# Altium project PCB_Project.PrjPcb
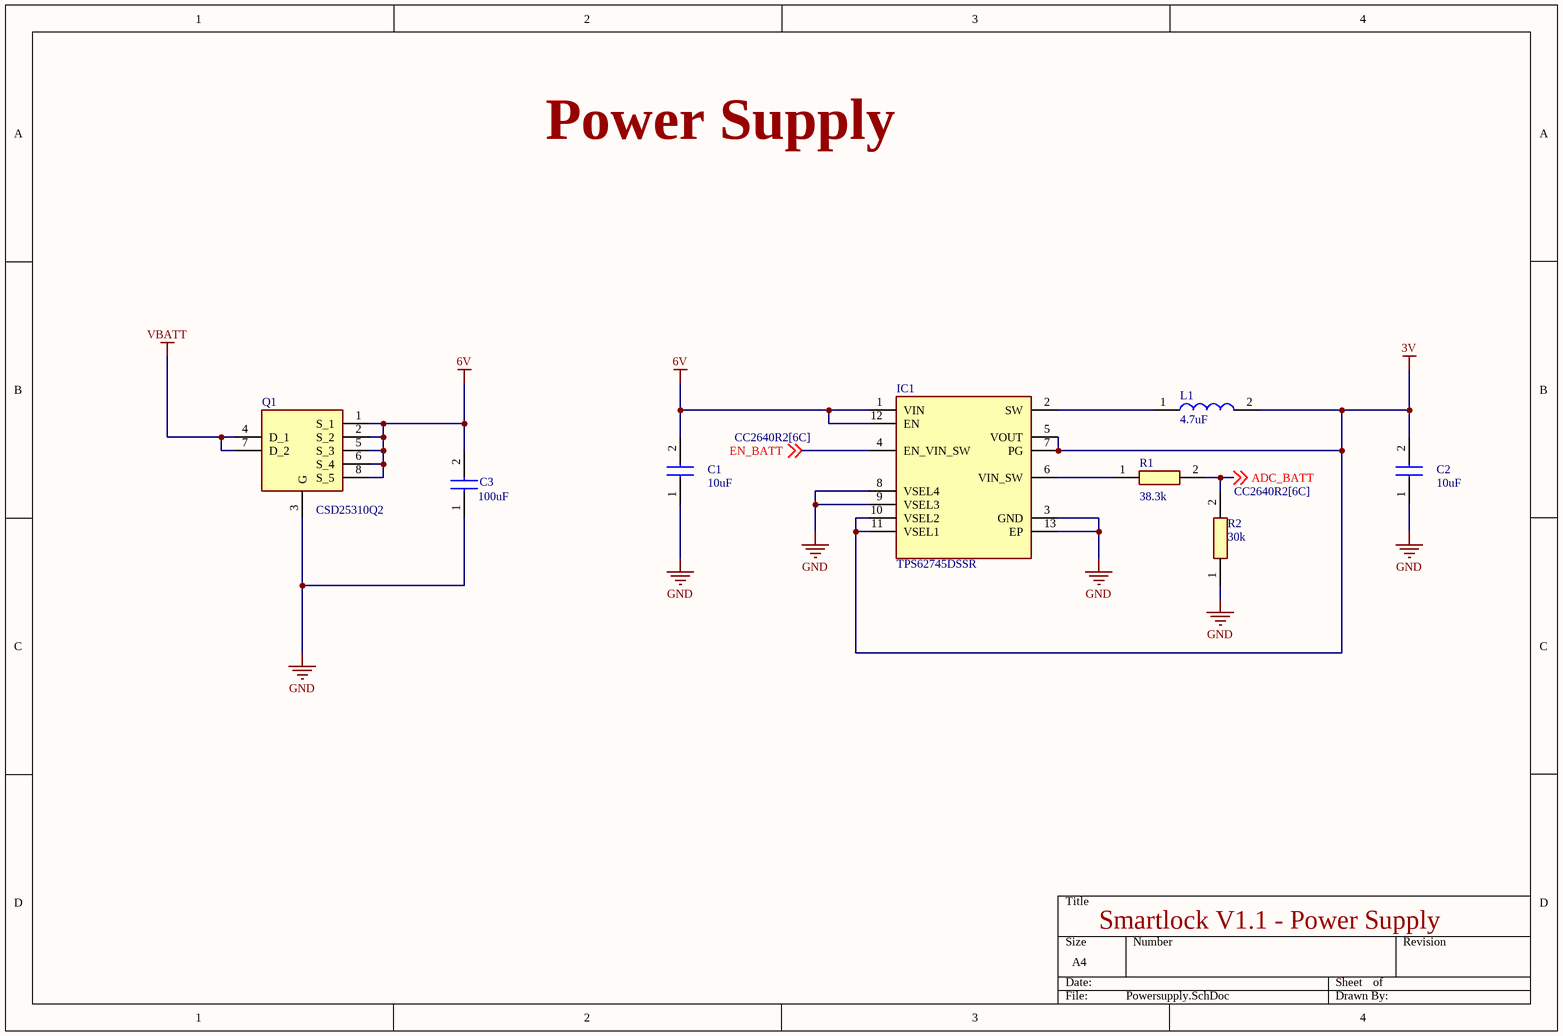
[diagram p0: Powersupply.SchDoc]
4 sheets, 74 parts. Net scope: global (net labels, ports and power ports of the same name join across sheets).
Board file: Smart_lockV1.1.PcbDoc
Sheets:
  Powersupply.SchDoc
  DRV8833_Motordrive.SchDoc
  CC2640R2.SchDoc
  LP55231 LED DRIVER.SchDoc

## Sheet Powersupply.SchDoc
size A4; SheetNumber: 1; SheetTotal: 4

### Parts
C1  10uF  [CAPC2114X145N]
C2  10uF  [CAPC2114X145N]
C3  100uF  [CAPC3216X180N]
IC1  TPS62745DSSR  [SON50P200X300X80-13N]
L1  4.7uF  [INDC3225X270N]
Q1  CSD25310Q2  [CSD17313Q2]
R1  38.3k  [RESC1608X55N]
R2  30k  [RESC1608X55N]

### Nets
3V: C2.2 IC1.5(VOUT) IC1.7(PG) IC1.10(VSEL2) IC1.11(VSEL1) L1.2
6V: C1.2 C3.2 IC1.1(VIN) IC1.12(EN) Q1.1(S_1) Q1.2(S_2) Q1.5(S_3) Q1.6(S_4) Q1.8(S_5)
GND: C1.1 C2.1 C3.1 IC1.3(GND) IC1.8(VSEL4) IC1.9(VSEL3) IC1.13(EP) Q1.3(G) R2.1
VBATT: Q1.4(D_1) Q1.7(D_2)
ADC_BATT: R1.2 R2.2 ; off-sheet ADC_BATT
EN_BATT: IC1.4(EN_VIN_SW) ; off-sheet EN_BATT
NetIC1_2: IC1.2(SW) L1.1
NetIC1_6: IC1.6(VIN_SW) R1.1

### Notes on the sheet
- Power Supply
- Smartlock V1.1 - Power Supply

### Library data of the parts
C1 = EMK212BB7106MG-T: 10uF,16V,X7R; Manufacturer_Name: TAIYO YUDEN; Datasheet Link: https://datasheet.datasheetarchive.com/originals/distributors/Datasheets-DGA20/25674.pdf; Height: 1.45mm; Manufacturer_Part_Number: EMK212BB7106MG-T; Mouser Part Number: 963-EMK212BB7106MG-T; Mouser Price/Stock: https://www.mouser.co.uk/ProductDetail/TAIYO-YUDEN/EMK212BB7106MG-T?qs=CNQs48zzdnoVUZzBq71rnA%3D%3D
C2 = EMK212BB7106MG-T: Capacitor,10uF,16V; Manufacturer_Name: TAIYO YUDEN; Datasheet Link: https://datasheet.datasheetarchive.com/originals/distributors/Datasheets-DGA20/25674.pdf; Height: 1.45mm; Manufacturer_Part_Number: EMK212BB7106MG-T; Mouser Part Number: 963-EMK212BB7106MG-T; Mouser Price/Stock: https://www.mouser.co.uk/ProductDetail/TAIYO-YUDEN/EMK212BB7106MG-T?qs=CNQs48zzdnoVUZzBq71rnA%3D%3D
C3 = C3216X5R1A107M160AC: Capacitor,100uF,X7R; Manufacturer_Name: TDK; Datasheet Link: https://product.tdk.com/info/en/catalog/datasheets/mlcc_commercial_midvoltage_en.pdf; Height: 1.8mm; Manufacturer_Part_Number: C3216X5R1A107M160AC; Mouser Part Number: 810-C3216X5R1A107M; Mouser Price/Stock: https://www.mouser.co.uk/ProductDetail/TDK/C3216X5R1A107M160AC?qs=NRhsANhppD%252B0MpDu1pf9NA%3D%3D; Arrow Part Number: C3216X5R1A107M160AC; Arrow Price/Stock: https://www.arrow.com/en/products/c3216x5r1a107m160ac/tdk?region=nac
IC1 = TPS62745DSSR: Integrated Circuit; Manufacturer_Name: Texas Instruments; Datasheet Link: http://www.ti.com/lit/gpn/tps62745; Height: 0.8mm; Manufacturer_Part_Number: TPS62745DSSR; Mouser Part Number: 595-TPS62745DSSR; Mouser Price/Stock: https://www.mouser.co.uk/ProductDetail/Texas-Instruments/TPS62745DSSR?qs=cGEy3R83DS9Bx52nwzd43Q%3D%3D; Arrow Part Number: TPS62745DSSR; Arrow Price/Stock: https://www.arrow.com/en/products/tps62745dssr/texas-instruments?region=nac
L1 = CBC3225T4R7MRV: Inductor,4.7uF,1.01A,0.1ohm; Manufacturer_Name: TAIYO YUDEN; Datasheet Link: https://www.arrow.com/en/products/cbc3225t4r7mrv/taiyo-yuden; Height: 2.7mm; Manufacturer_Part_Number: CBC3225T4R7MRV; Mouser Part Number: 963-CBC3225T4R7MRV; Mouser Price/Stock: https://www.mouser.co.uk/ProductDetail/TAIYO-YUDEN/CBC3225T4R7MRV?qs=DpxmIIQLg%252BP760DvOSan2w%3D%3D; Arrow Part Number: CBC3225T4R7MRV; Arrow Price/Stock: https://www.arrow.com/en/products/cbc3225t4r7mrv/taiyo-yuden
Q1 = CSD25310Q2: MOSFET (P-Channel); Manufacturer_Name: Texas Instruments; Datasheet Link: http://www.ti.com/lit/gpn/csd25310q2; Manufacturer_Part_Number: CSD25310Q2; Mouser Part Number: 595-CSD25310Q2; Mouser Price/Stock: https://www.mouser.co.uk/ProductDetail/Texas-Instruments/CSD25310Q2?qs=%252BFzhjShcsaLmTjZr5cnj9w%3D%3D; Arrow Part Number: CSD25310Q2; Arrow Price/Stock: https://www.arrow.com/en/products/csd25310q2/texas-instruments?region=nac
R1 = RC0603FR-0738K3L: Resistor,38.3k; Manufacturer_Name: KEMET; Datasheet Link: http://www.yageo.com/documents/recent/PYu-RC0603_51_RoHS_L_v5.pdf; Height: 0.55mm; Manufacturer_Part_Number: RC0603FR-0738K3L
R2 = ERJ-3EKF3002V: Resistor,30k,1%; Manufacturer_Name: Panasonic; Datasheet Link: http://industrial.panasonic.com/cdbs/www-data/pdf/RDA0000/AOA0000C86.pdf; Height: 0.55mm; Manufacturer_Part_Number: ERJ-3EKF3002V; Mouser Part Number: 667-ERJ-3EKF3002V; Mouser Price/Stock: https://www.mouser.co.uk/ProductDetail/Panasonic/ERJ-3EKF3002V?qs=MVjVSMjNRMoByeEjjMcfzA%3D%3D; Arrow Part Number: ERJ-3EKF3002V; Arrow Price/Stock: https://www.arrow.com/en/products/erj3ekf3002v/panasonic?region=nac

## Sheet DRV8833_Motordrive.SchDoc
size A4; SheetNumber: 2; SheetTotal: 4
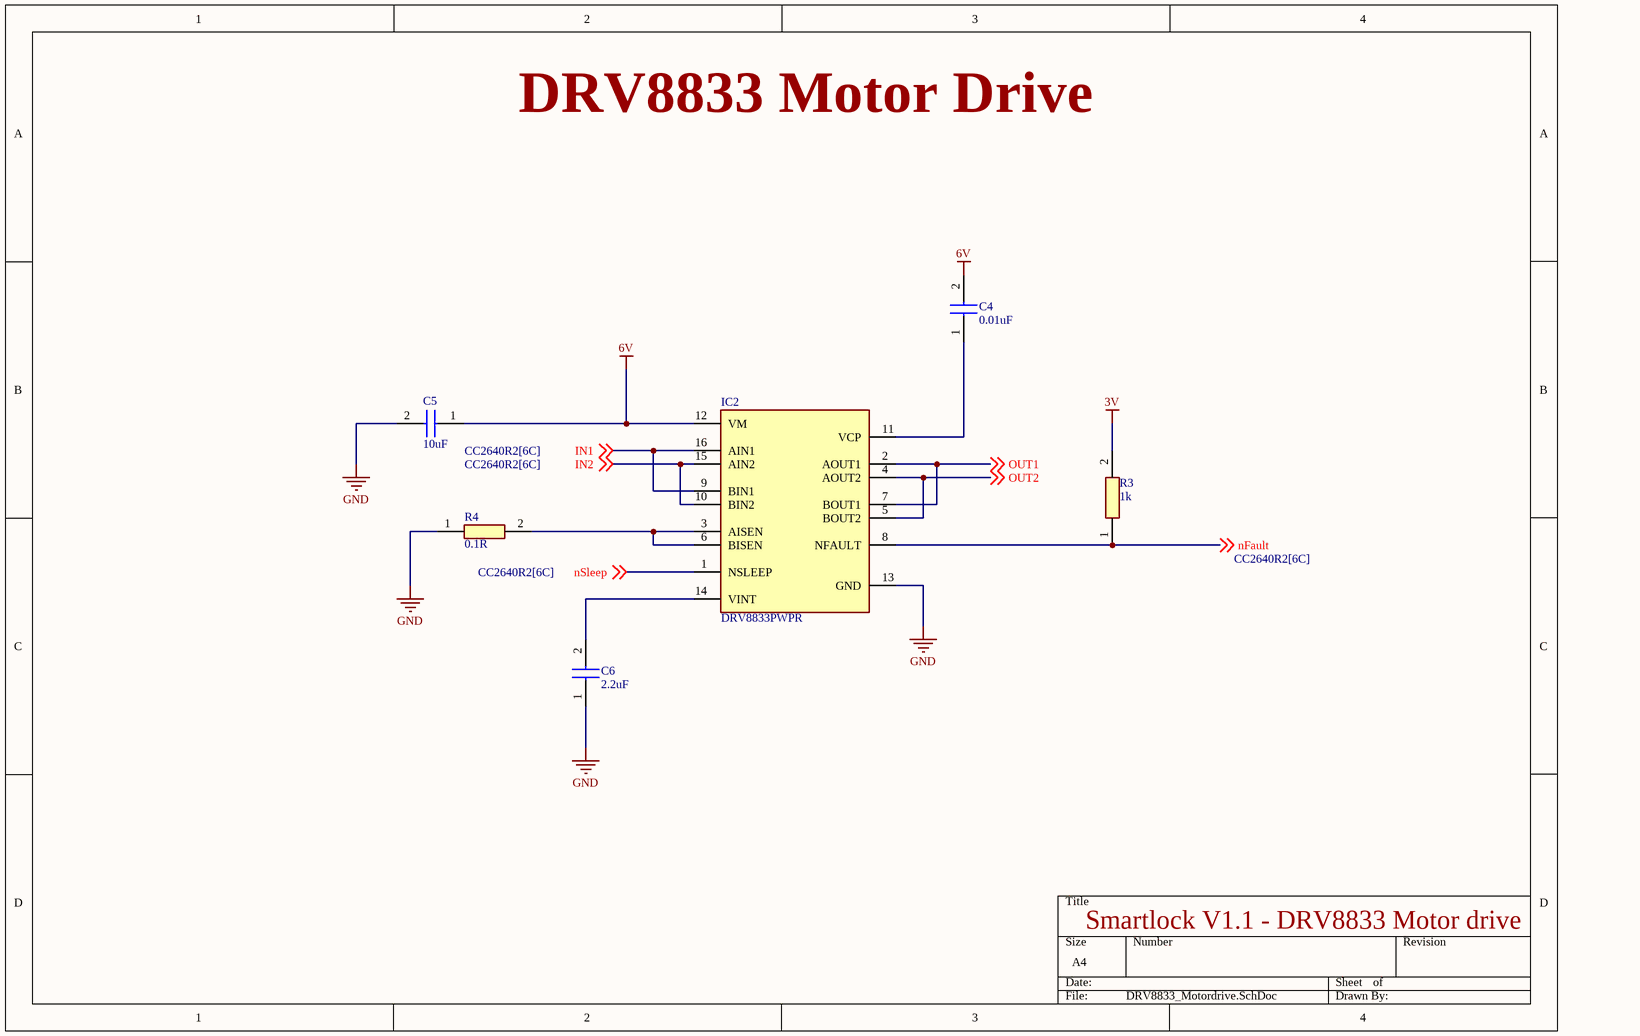
[diagram p1: DRV8833_Motordrive.SchDoc]

### Parts
C4  0.01uF  [CAPC1005X55N]
C5  10uF  [CAPC2114X145N]
C6  2.2uF  [C0603]
IC2  DRV8833PWPR  [SOP65P640X120-16N]
R3  1k  [RESC1608X55N]
R4  0.1R  [CSR1206]

### Nets
3V: R3.2
6V: C4.2 C5.1 IC2.12(VM)
GND: C5.2 C6.1 IC2.13(GND) R4.1
IN1: IC2.9(BIN1) IC2.16(AIN1) ; off-sheet IN1
IN2: IC2.10(BIN2) IC2.15(AIN2) ; off-sheet IN2
nFault: IC2.8(NFAULT) R3.1 ; off-sheet nFault
nSleep: IC2.1(NSLEEP) ; off-sheet nSleep
OUT1: IC2.2(AOUT1) IC2.7(BOUT1) ; off-sheet OUT1
OUT2: IC2.4(AOUT2) IC2.5(BOUT2) ; off-sheet OUT2
NetC4_1: C4.1 IC2.11(VCP)
NetC6_2: C6.2 IC2.14(VINT)
NetIC2_3: IC2.3(AISEN) IC2.6(BISEN) R4.2

### Notes on the sheet
- DRV8833 Motor Drive
- Smartlock V1.1 - DRV8833 Motor drive

### Library data of the parts
C4 = C1005X7R1C103K050BA: Capacitor,0.01uF; Manufacturer_Name: TDK; Datasheet Link: https://product.tdk.com/info/en/catalog/datasheets/mlcc_commercial_midvoltage_en.pdf; Height: 0.55mm; Manufacturer_Part_Number: C1005X7R1C103K050BA; Mouser Part Number: 810-C1005X7R1C103K; Mouser Price/Stock: https://www.mouser.co.uk/ProductDetail/TDK/C1005X7R1C103K050BA?qs=NRhsANhppD%252Bt7xPr32kpQA%3D%3D; Arrow Part Number: C1005X7R1C103K050BA; Arrow Price/Stock: https://www.arrow.com/en/products/c1005x7r1c103k050ba/tdk?region=nac
C5 = EMK212BB7106MG-T: Capacitor,10uF,16V X7R; Manufacturer_Name: TAIYO YUDEN; Datasheet Link: https://datasheet.datasheetarchive.com/originals/distributors/Datasheets-DGA20/25674.pdf; Height: 1.45mm; Manufacturer_Part_Number: EMK212BB7106MG-T; Mouser Part Number: 963-EMK212BB7106MG-T; Mouser Price/Stock: https://www.mouser.co.uk/ProductDetail/TAIYO-YUDEN/EMK212BB7106MG-T?qs=CNQs48zzdnoVUZzBq71rnA%3D%3D
C6 = C0603C225K9PACTU: Capacitor,2.2uF,X5R,6.3V; Manufacturer_Name: KEMET; Datasheet Link: https://content.kemet.com/datasheets/KEM_C1006_X5R_SMD.pdf; Height: 0.87mm; Manufacturer_Part_Number: C0603C225K9PACTU; Mouser Part Number: 80-C0603C225K9P; Mouser Price/Stock: https://www.mouser.co.uk/ProductDetail/KEMET/C0603C225K9PACTU?qs=k9TrThuu1pdUHTgQc%252B%2FY%252Bg%3D%3D; Arrow Part Number: C0603C225K9PACTU; Arrow Price/Stock: https://www.arrow.com/en/products/c0603c225k9pactu/kemet-corporation?region=nac
IC2 = DRV8833PWPR: Integrated Circuit; Manufacturer_Name: Texas Instruments; Datasheet Link: http://www.ti.com/lit/gpn/drv8833; Height: 1.2mm; Manufacturer_Part_Number: DRV8833PWPR; Mouser Part Number: 595-DRV8833PWPR; Mouser Price/Stock: https://www.mouser.co.uk/ProductDetail/Texas-Instruments/DRV8833PWPR?qs=luhu8ESwuKxT62RV9jrJTg%3D%3D; Arrow Part Number: DRV8833PWPR; Arrow Price/Stock: https://www.arrow.com/en/products/drv8833pwpr/texas-instruments?utm_currency=USD&region=europe
R3 = ERJ-3EKF3002V: Resistor,1k; Manufacturer_Name: Panasonic; Datasheet Link: http://industrial.panasonic.com/cdbs/www-data/pdf/RDA0000/AOA0000C86.pdf; Height: 0.55mm; Manufacturer_Part_Number: ERJ-3EKF3002V; Mouser Part Number: 667-ERJ-3EKF3002V; Mouser Price/Stock: https://www.mouser.co.uk/ProductDetail/Panasonic/ERJ-3EKF3002V?qs=MVjVSMjNRMoByeEjjMcfzA%3D%3D; Arrow Part Number: ERJ-3EKF3002V; Arrow Price/Stock: https://www.arrow.com/en/products/erj3ekf3002v/panasonic?region=nac
R4 = CSR1206FKR100: Resistor,0.1R; Manufacturer_Name: Stackpole Electronics; Datasheet Link: https://cs.seielect.com/catalog/SEI-CSR_CSRN.pdf; Height: 0.65mm; Manufacturer_Part_Number: CSR1206FKR100; Mouser Part Number: 708-CSR1206FKR100; Mouser Price/Stock: https://www.mouser.co.uk/ProductDetail/SEI-Stackpole/CSR1206FKR100?qs=FESYatJ8odJJ%2Fwfc%252BjDDcQ%3D%3D

## Sheet CC2640R2.SchDoc
size A2; SheetNumber: 3; SheetTotal: 4
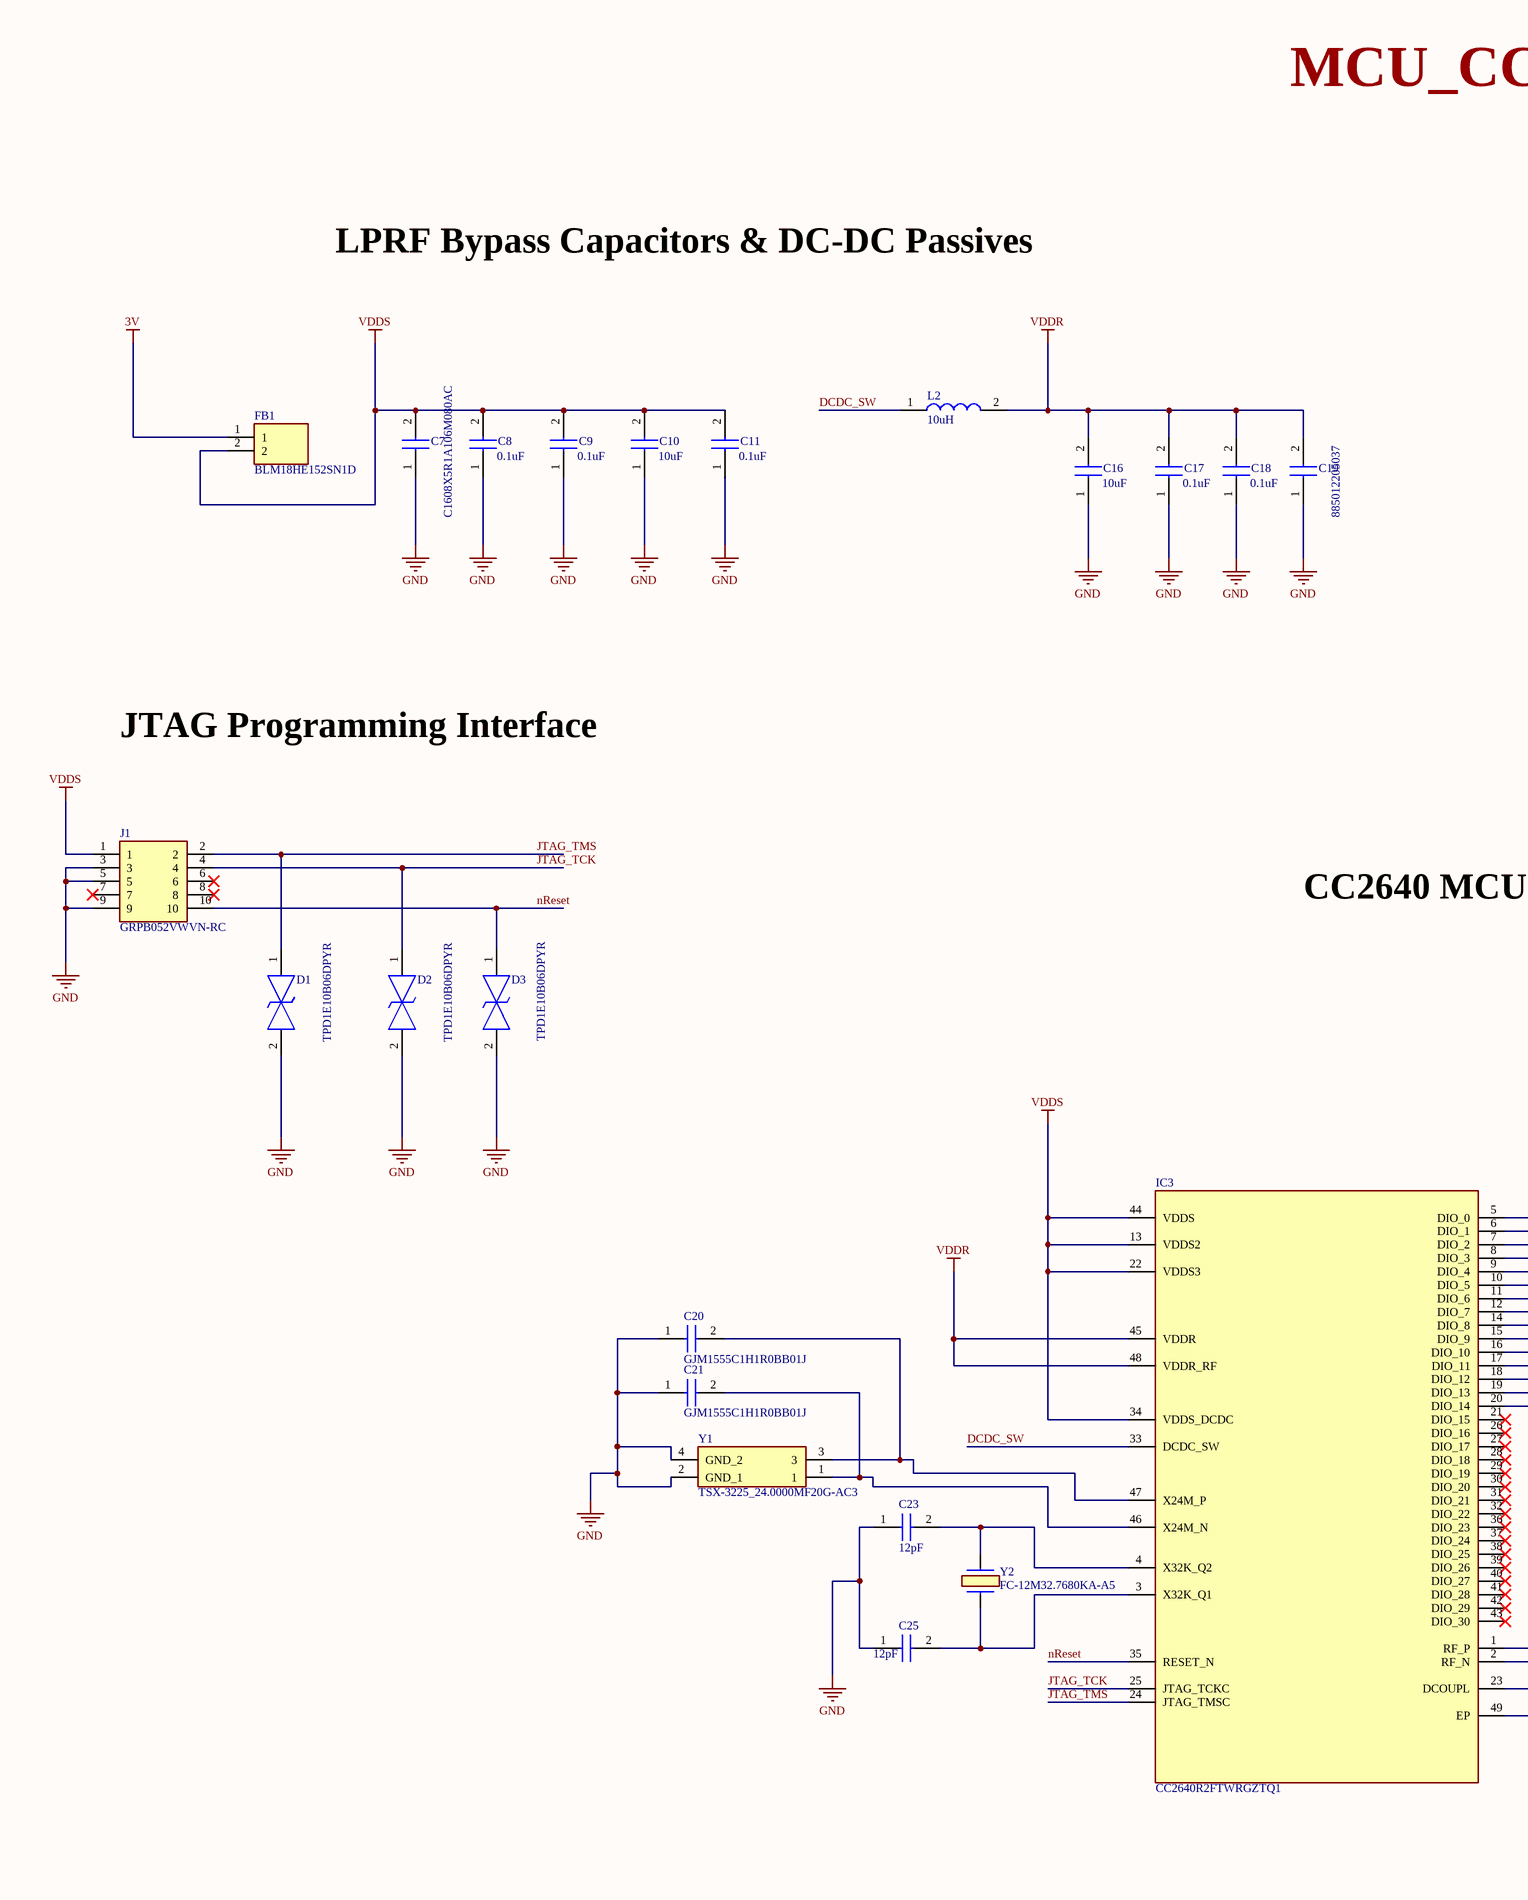
[diagram p2: CC2640R2.SchDoc, left]
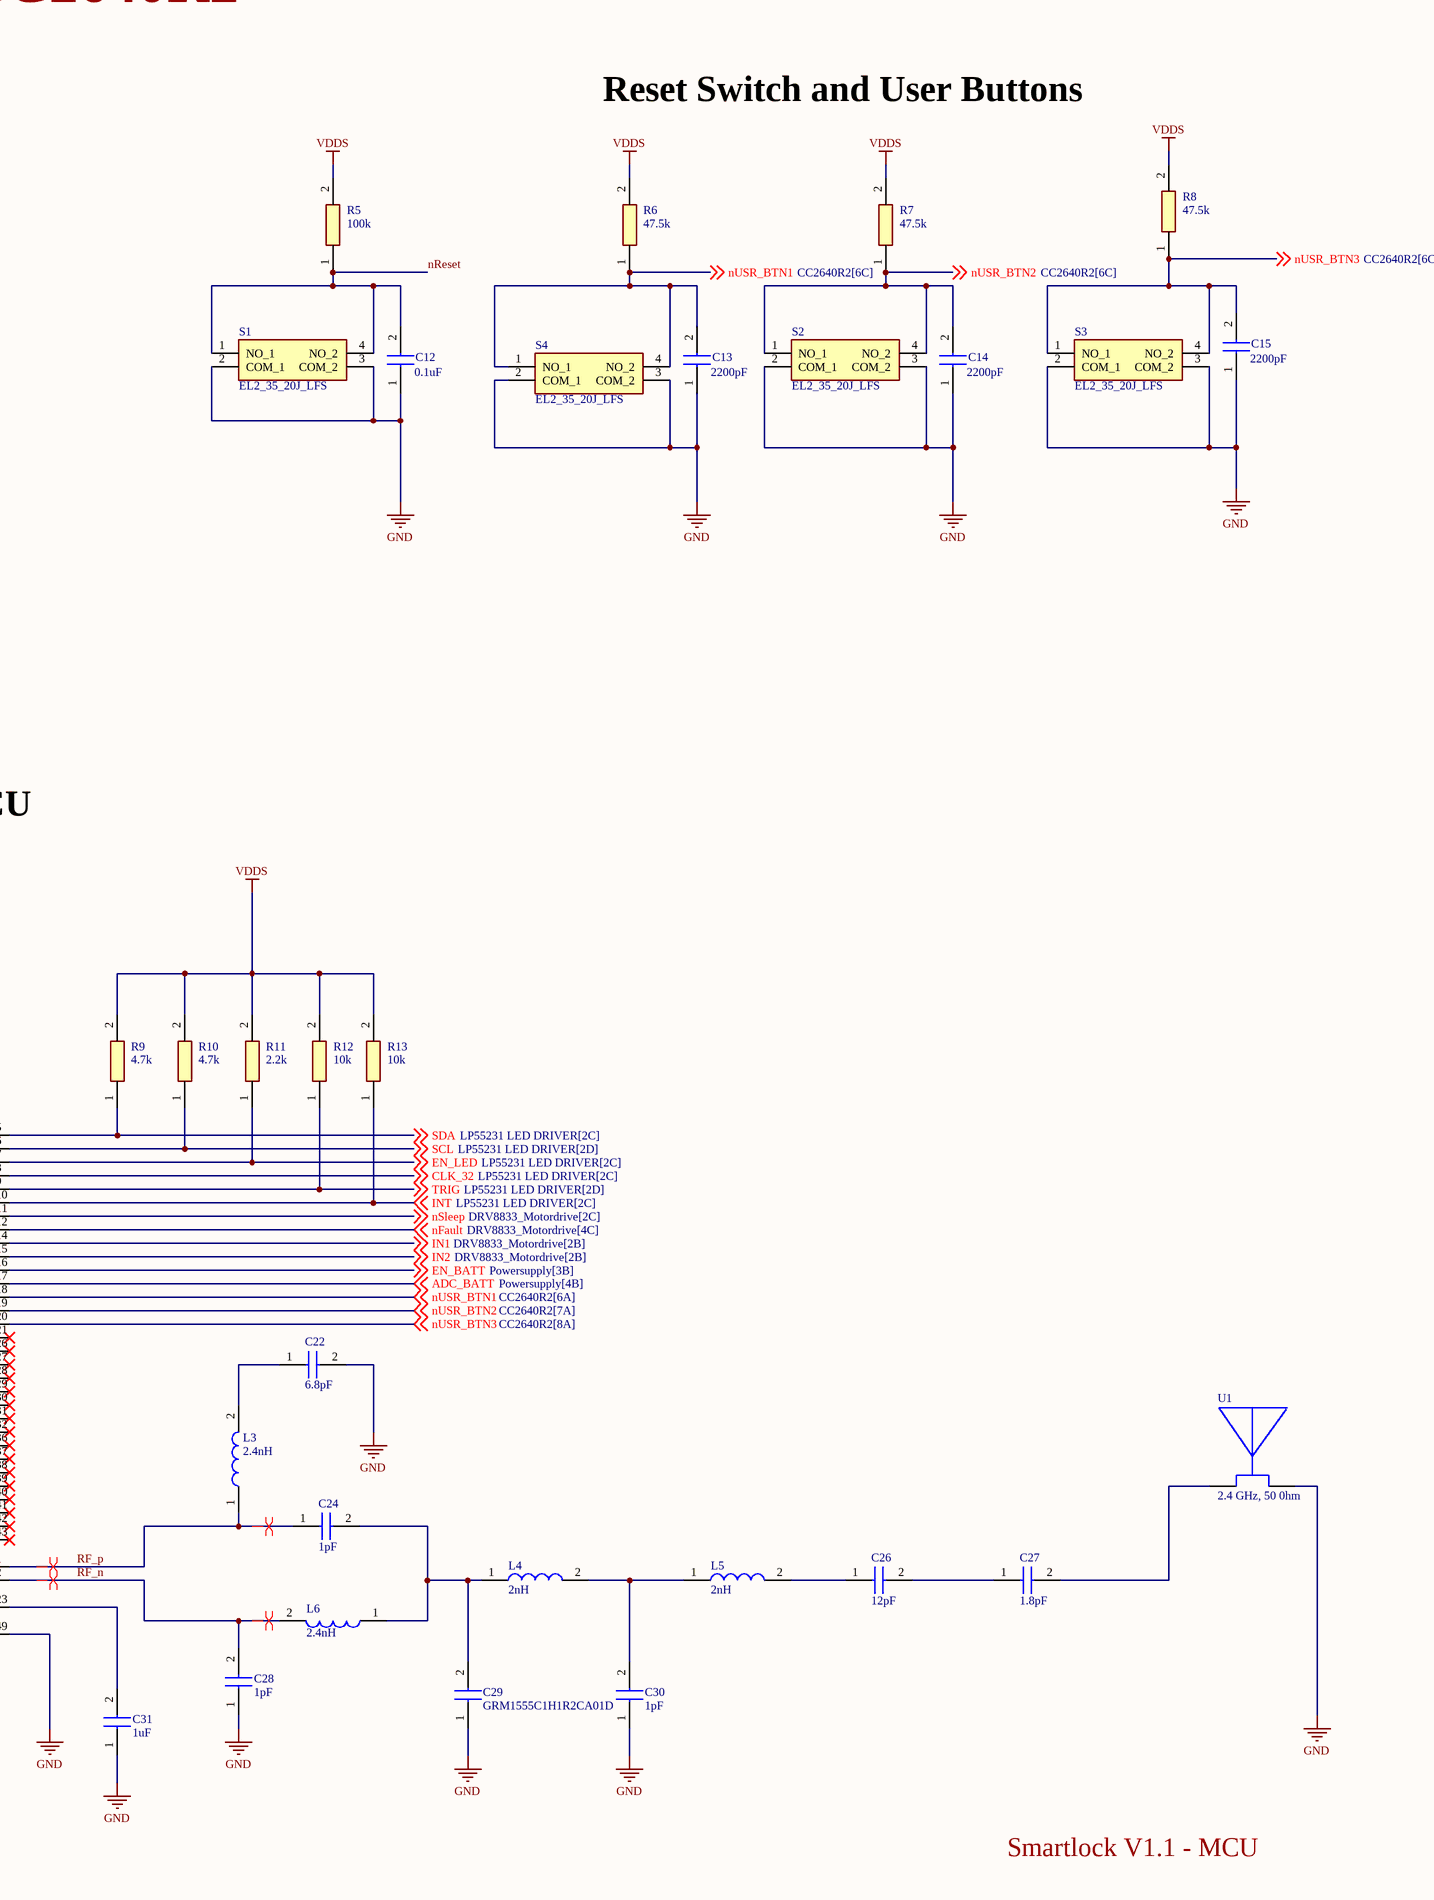
[diagram p3: CC2640R2.SchDoc, right]

### Parts
C7  C1608X5R1A106M080AC  [CAPC1608X80N]
C8  0.1uF  [CAPC1005X55N]
C9  0.1uF  [CAPC1005X55N]
C10  10uF  [CAPC2012X145N]
C11  0.1uF  [CAPC1005X55N]
C12  0.1uF  [CAPC1005X55N]
C13  2200pF  [CAPC1005X55N]
C14  2200pF  [CAPC1005X55N]
C15  2200pF  [CAPC1005X55N]
C16  10uF  [CAPC2012X145N]
C17  0.1uF  [CAPC1005X55N]
C18  0.1uF  [CAPC1005X55N]
C19  885012205037  [CAPC1005X55N]
C20  GJM1555C1H1R0BB01J  [CAPC1005X55N]
C21  GJM1555C1H1R0BB01J  [CAPC1005X55N]
C22  6.8pF  [CAPC1005X55N]
C23  12pF  [CAPC1005X55N]
C24  1pF  [CAPC1005X55N]
C25  12pF  [CAPC1005X55N]
C26  12pF  [CAPC1005X55N]
C27  1.8pF  [CAPC1005X55N]
C28  1pF  [CAPC1005X55N]
C29  GRM1555C1H1R2CA01D  [CAPC1005X55N]
C30  1pF  [CAPC1005X55N]
C31  1uF  [CAPC1005X55N]
D1  TPD1E10B06DPYR  [TPD1E10B06DPYR]
D2  TPD1E10B06DPYR  [TPD1E10B06DPYR]
D3  TPD1E10B06DPYR  [TPD1E10B06DPYR]
FB1  BLM18HE152SN1D  [BLM18SP221SN1B]
IC3  CC2640R2FTWRGZTQ1  [QFN50P700X700X100-49N-D]
J1  GRPB052VWVN-RC  [HDRV10W50P127_2X5_635X340X430P]
L2  10uH  [INDC2112X145N]
L3  2.4nH  [LQG15WH0N7B02D]
L4  2nH  [LQG15WH0N7B02D]
L5  2nH  [LQG15WH0N7B02D]
L6  2.4nH  [LQG15WH0N7B02D]
R5  100k  [RESC1005X35N]
R6  47.5k  [RESC1005X40N]
R7  47.5k  [RESC1005X40N]
R8  47.5k  [RESC1005X40N]
R9  4.7k  [ERJ3EKF1000V]
R10  4.7k  [ERJ3EKF1000V]
R11  2.2k  [RESC1608X55N]
R12  10k  [RESC1608X55N]
R13  10k  [RESC1608X55N]
S1  EL2_35_20J_LFS  [EL23520JLFS]
S2  EL2_35_20J_LFS  [EL23520JLFS]
S3  EL2_35_20J_LFS  [EL23520JLFS]
S4  EL2_35_20J_LFS  [EL23520JLFS]
U1  2.4 GHz, 50 0hm  [ANT_IFA_USB_2_4GHZ_50R]
Y1  TSX-3225_24.0000MF20G-AC3  [TSX-3225]
Y2  FC-12M32.7680KA-A5  [FC12M327680KAA5]

### Nets
3V: FB1.1
GND: C7.1 C8.1 C9.1 C10.1 C11.1 C12.1 C13.1 C14.1 C15.1 C16.1 C17.1 C18.1 C19.1 C20.1 C21.1 C22.2 C23.1 C25.1 C28.1 C29.1 C30.1 C31.1 D1.2 D2.2 D3.2 IC3.49(EP) J1.3 J1.5 J1.9 S1.2(COM_1) S1.3(COM_2) S2.2(COM_1) S2.3(COM_2) S3.2(COM_1) S3.3(COM_2) S4.2(COM_1) S4.3(COM_2) U1.2(GND) Y1.2(GND_1) Y1.4(GND_2)
VDDR: C16.2 C17.2 C18.2 C19.2 IC3.45(VDDR) IC3.48(VDDR_RF) L2.2
VDDS: C7.2 C8.2 C9.2 C10.2 C11.2 FB1.2 IC3.13(VDDS2) IC3.22(VDDS3) IC3.34(VDDS_DCDC) IC3.44(VDDS) J1.1 R5.2 R6.2 R7.2 R8.2 R9.2 R10.2 R11.2 R12.2 R13.2
ADC_BATT: IC3.17(DIO_11) ; off-sheet ADC_BATT
CLK_32: IC3.8(DIO_3) ; off-sheet CLK_32
DCDC_SW: IC3.33(DCDC_SW) L2.1
EN_BATT: IC3.16(DIO_10) ; off-sheet EN_BATT
EN_LED: IC3.7(DIO_2) R11.1 ; off-sheet EN_LED
IN1: IC3.14(DIO_8) ; off-sheet IN1
IN2: IC3.15(DIO_9) ; off-sheet IN2
INT: IC3.10(DIO_5) R13.1 ; off-sheet INT
JTAG_TCK: D2.1 IC3.25(JTAG_TCKC) J1.4
JTAG_TMS: D1.1 IC3.24(JTAG_TMSC) J1.2
nFault: IC3.12(DIO_7) ; off-sheet nFault
nReset: C12.2 D3.1 IC3.35(RESET_N) J1.10 R5.1 S1.1(NO_1) S1.4(NO_2)
nSleep: IC3.11(DIO_6) ; off-sheet nSleep
nUSR_BTN1: C13.2 IC3.18(DIO_12) R6.1 S4.1(NO_1) S4.4(NO_2) ; off-sheet nUSR_BTN1
nUSR_BTN2: C14.2 IC3.19(DIO_13) R7.1 S2.1(NO_1) S2.4(NO_2) ; off-sheet nUSR_BTN2
nUSR_BTN3: C15.2 IC3.20(DIO_14) R8.1 S3.1(NO_1) S3.4(NO_2) ; off-sheet nUSR_BTN3
RF_n: C28.2 IC3.2(RF_N) L6.2
RF_p: C24.1 IC3.1(RF_P) L3.1
SCL: IC3.6(DIO_1) R10.1 ; off-sheet SCL
SDA: IC3.5(DIO_0) R9.1 ; off-sheet SDA
TRIG: IC3.9(DIO_4) R12.1 ; off-sheet TRIG
NetC20_2: C20.2 IC3.47(X24M_P) Y1.3
NetC21_2: C21.2 IC3.46(X24M_N) Y1.1
NetC22_1: C22.1 L3.2
NetC23_2: C23.2 IC3.4(X32K_Q2) Y2.1
NetC24_2: C24.2 C29.2 L4.1 L6.1
NetC25_2: C25.2 IC3.3(X32K_Q1) Y2.2
NetC26_1: C26.1 L5.2
NetC26_2: C26.2 C27.1
NetC27_2: C27.2 U1.1
NetC30_2: C30.2 L4.2 L5.1
NetC31_2: C31.2 IC3.23(DCOUPL)

Not connected (* = marked no-connect by the designer): IC3 21(DIO_15)* 26(DIO_16)* 27(DIO_17)* 28(DIO_18)* 29(DIO_19)* 30(DIO_20)* 31(DIO_21)* 32(DIO_22)* 36(DIO_23)* 37(DIO_24)* 38(DIO_25)* 39(DIO_26)* 40(DIO_27)* 41(DIO_28)* 42(DIO_29)* 43(DIO_30)*; J1 6* 7* 8*

### Layout directives
differential pair: RF_n, RF_p

### Notes on the sheet
- MCU_CC2640R2
- Reset Switch and User Buttons
- LPRF Bypass Capacitors & DC-DC Passives
- JTAG Programming Interface
- CC2640 MCU
- Smartlock V1.1 - MCU

### Library data of the parts
C7 = C1608X5R1A106M080AC: Capacitor; Manufacturer_Name: TDK; Datasheet Link: https://product.tdk.com/info/en/catalog/datasheets/mlcc_commercial_midvoltage_en.pdf; Height: 0.8mm; Manufacturer_Part_Number: C1608X5R1A106M080AC; Mouser Part Number: 810-C1608X5R1A106M; Mouser Price/Stock: https://www.mouser.co.uk/ProductDetail/TDK/C1608X5R1A106M080AC?qs=NRhsANhppD%2FNXUUBltaPzw%3D%3D; Arrow Part Number: C1608X5R1A106M080AC; Arrow Price/Stock: https://www.arrow.com/en/products/c1608x5r1a106m080ac/tdk?region=nac
C8 C9 = GRM155R71A104KA01D: Capacitor,0.1uF 10V X7R; Manufacturer_Name: Murata Electronics; Datasheet Link: http://www.murata.com/~/media/webrenewal/support/library/catalog/products/capacitor/mlcc/c02e.pdf; Height: 0.55mm; Manufacturer_Part_Number: GRM155R71A104KA01D; Mouser Part Number: 81-GRM155R71A104KA1D; Mouser Price/Stock: https://www.mouser.co.uk/ProductDetail/Murata-Electronics/GRM155R71A104KA01D?qs=8YPuuxuUzMIpJ%252BESZ%2Fj8CQ%3D%3D; Arrow Part Number: GRM155R71A104KA01D; Arrow Price/Stock: https://www.arrow.com/en/products/grm155r71a104ka01d/murata-manufacturing?region=nac
C10 = GRM21BR71A106KE51L: Capacitor,10uF 10V X7R; Manufacturer_Name: Murata Electronics; Datasheet Link: http://www.murata.com/~/media/webrenewal/support/library/catalog/products/capacitor/mlcc/c02e.pdf; Height: 1.45mm; Manufacturer_Part_Number: GRM21BR71A106KE51L; Mouser Part Number: 81-GRM21BR71A106KE51; Mouser Price/Stock: https://www.mouser.co.uk/ProductDetail/Murata-Electronics/GRM21BR71A106KE51L?qs=kHCDrmfBqSAdNFLacabF8w%3D%3D; Arrow Part Number: GRM21BR71A106KE51L; Arrow Price/Stock: https://www.arrow.com/en/products/grm21br71a106ke51l/murata-manufacturing
C11 = GRM155R71A104KA01D: Capacitor,01uF 10V X7R; Manufacturer_Name: Murata Electronics; Datasheet Link: http://www.murata.com/~/media/webrenewal/support/library/catalog/products/capacitor/mlcc/c02e.pdf; Height: 0.55mm; Manufacturer_Part_Number: GRM155R71A104KA01D; Mouser Part Number: 81-GRM155R71A104KA1D; Mouser Price/Stock: https://www.mouser.co.uk/ProductDetail/Murata-Electronics/GRM155R71A104KA01D?qs=8YPuuxuUzMIpJ%252BESZ%2Fj8CQ%3D%3D; Arrow Part Number: GRM155R71A104KA01D; Arrow Price/Stock: https://www.arrow.com/en/products/grm155r71a104ka01d/murata-manufacturing?region=nac
C12 = CGA2B3X7R1E104K050BB: Capacitor 0.1uF 25V; Manufacturer_Name: TDK; Datasheet Link: http://docs-europe.electrocomponents.com/webdocs/14e9/0900766b814e9125.pdf; Height: 0.55mm; Manufacturer_Part_Number: CGA2B3X7R1E104K050BB; Mouser Part Number: 810-CGA2B3X7R1E104K; Mouser Price/Stock: https://www.mouser.co.uk/ProductDetail/TDK/CGA2B3X7R1E104K050BB?qs=NRhsANhppD8vfw6RTbl%2FmA%3D%3D; Arrow Part Number: CGA2B3X7R1E104K050BB; Arrow Price/Stock: https://www.arrow.com/en/products/cga2b3x7r1e104k050bb/tdk
C13 = C1005X7R1H222K050BA: Capacitor 2200pF 50V; Manufacturer_Name: TDK; Datasheet Link: https://product.tdk.com/info/en/catalog/datasheets/mlcc_commercial_midvoltage_en.pdf; Height: 0.55mm; Manufacturer_Part_Number: C1005X7R1H222K050BA; Mouser Part Number: 810-C1005X7R1H222K; Mouser Price/Stock: https://www.mouser.co.uk/ProductDetail/TDK/C1005X7R1H222K050BA?qs=NRhsANhppD9DKOaxmnLFog%3D%3D
C14 C15 = C1005X7R1H222K050BA: Capacitor; Manufacturer_Name: TDK; Datasheet Link: https://product.tdk.com/info/en/catalog/datasheets/mlcc_commercial_midvoltage_en.pdf; Height: 0.55mm; Manufacturer_Part_Number: C1005X7R1H222K050BA; Mouser Part Number: 810-C1005X7R1H222K; Mouser Price/Stock: https://www.mouser.co.uk/ProductDetail/TDK/C1005X7R1H222K050BA?qs=NRhsANhppD9DKOaxmnLFog%3D%3D
C16 = GRM21BR71A106KE51L: Capacitor 10uF 10V X7R; Manufacturer_Name: Murata Electronics; Datasheet Link: http://www.murata.com/~/media/webrenewal/support/library/catalog/products/capacitor/mlcc/c02e.pdf; Height: 1.45mm; Manufacturer_Part_Number: GRM21BR71A106KE51L; Mouser Part Number: 81-GRM21BR71A106KE51; Mouser Price/Stock: https://www.mouser.co.uk/ProductDetail/Murata-Electronics/GRM21BR71A106KE51L?qs=kHCDrmfBqSAdNFLacabF8w%3D%3D; Arrow Part Number: GRM21BR71A106KE51L; Arrow Price/Stock: https://www.arrow.com/en/products/grm21br71a106ke51l/murata-manufacturing
C17 C18 = GRM155R71A104KA01D: Capacitor 0.1uF 10V X7R; Manufacturer_Name: Murata Electronics; Datasheet Link: http://www.murata.com/~/media/webrenewal/support/library/catalog/products/capacitor/mlcc/c02e.pdf; Height: 0.55mm; Manufacturer_Part_Number: GRM155R71A104KA01D; Mouser Part Number: 81-GRM155R71A104KA1D; Mouser Price/Stock: https://www.mouser.co.uk/ProductDetail/Murata-Electronics/GRM155R71A104KA01D?qs=8YPuuxuUzMIpJ%252BESZ%2Fj8CQ%3D%3D; Arrow Part Number: GRM155R71A104KA01D; Arrow Price/Stock: https://www.arrow.com/en/products/grm155r71a104ka01d/murata-manufacturing?region=nac
C19 = 885012205037: Capacitor; Manufacturer_Name: Wurth Elektronik; Datasheet Link: https://katalog.we-online.com/pbs/datasheet/885012205037.pdf; Height: 0.55mm; Manufacturer_Part_Number: 885012205037; Mouser Part Number: 710-885012205037; Mouser Price/Stock: https://www.mouser.co.uk/ProductDetail/Wurth-Elektronik/885012205037?qs=0KOYDY2FL2%252B%2FS6qIxdvsOA%3D%3D
C20 C21 = GJM1555C1H1R0BB01J: Capacitor; Manufacturer_Name: Murata Electronics; Datasheet Link: https://psearch.en.murata.com/capacitor/product/GJM1555C1H1R0BB01%23.html; Height: 0.55mm; Manufacturer_Part_Number: GJM1555C1H1R0BB01J; Mouser Part Number: 81-GJM1555C1H1R0BB1J; Mouser Price/Stock: https://www.mouser.co.uk/ProductDetail/Murata-Electronics/GJM1555C1H1R0BB01J?qs=QDXoN8f0aYKhYDjDsFjbQw%3D%3D; Arrow Part Number: GJM1555C1H1R0BB01J; Arrow Price/Stock: https://www.arrow.com/en/products/gjm1555c1h1r0bb01j/murata-manufacturing
C22 = GRM1555C1H6R8CA01D: 6.8pF Capacitor 50V; Manufacturer_Name: Murata Electronics; Datasheet Link: http://www.murata.com/~/media/webrenewal/support/library/catalog/products/capacitor/mlcc/c02e.pdf; Height: 0.55mm; Manufacturer_Part_Number: GRM1555C1H6R8CA01D; Mouser Part Number: 81-GRM1555C1H6R8CA1D; Mouser Price/Stock: https://www.mouser.co.uk/ProductDetail/Murata-Electronics/GRM1555C1H6R8CA01D?qs=q312vENifzChk4Wux6WqXA%3D%3D; Arrow Part Number: GRM1555C1H6R8CA01D; Arrow Price/Stock: https://www.arrow.com/en/products/grm1555c1h6r8ca01d/murata-manufacturing
C23 = GRM1555C1H120JA01D: Capacitor 12pF 50V; Manufacturer_Name: Murata Electronics; Datasheet Link: http://www.murata.com/~/media/webrenewal/support/library/catalog/products/capacitor/mlcc/c02e.pdf; Height: 0.55mm; Manufacturer_Part_Number: GRM1555C1H120JA01D; Mouser Part Number: 81-GRM1555C1H120JA1D; Mouser Price/Stock: https://www.mouser.co.uk/ProductDetail/Murata-Electronics/GRM1555C1H120JA01D?qs=to8XolpOzrOCHudLswyzbw%3D%3D; Arrow Part Number: GRM1555C1H120JA01D; Arrow Price/Stock: https://www.arrow.com/en/products/grm1555c1h120ja01d/murata-manufacturing?region=nac
C24 = GJM1555C1H1R0BB01J: Capacitor 1pF 50V; Manufacturer_Name: Murata Electronics; Datasheet Link: https://psearch.en.murata.com/capacitor/product/GJM1555C1H1R0BB01%23.html; Height: 0.55mm; Manufacturer_Part_Number: GJM1555C1H1R0BB01J; Mouser Part Number: 81-GJM1555C1H1R0BB1J; Mouser Price/Stock: https://www.mouser.co.uk/ProductDetail/Murata-Electronics/GJM1555C1H1R0BB01J?qs=QDXoN8f0aYKhYDjDsFjbQw%3D%3D; Arrow Part Number: GJM1555C1H1R0BB01J; Arrow Price/Stock: https://www.arrow.com/en/products/gjm1555c1h1r0bb01j/murata-manufacturing
C25 = GRM1555C1H120JA01D: Capacitor 12 pF 50V; Manufacturer_Name: Murata Electronics; Datasheet Link: http://www.murata.com/~/media/webrenewal/support/library/catalog/products/capacitor/mlcc/c02e.pdf; Height: 0.55mm; Manufacturer_Part_Number: GRM1555C1H120JA01D; Mouser Part Number: 81-GRM1555C1H120JA1D; Mouser Price/Stock: https://www.mouser.co.uk/ProductDetail/Murata-Electronics/GRM1555C1H120JA01D?qs=to8XolpOzrOCHudLswyzbw%3D%3D; Arrow Part Number: GRM1555C1H120JA01D; Arrow Price/Stock: https://www.arrow.com/en/products/grm1555c1h120ja01d/murata-manufacturing?region=nac
C26 = GRM1555C1H120JA01D: Capacitor; Manufacturer_Name: Murata Electronics; Datasheet Link: http://www.murata.com/~/media/webrenewal/support/library/catalog/products/capacitor/mlcc/c02e.pdf; Height: 0.55mm; Manufacturer_Part_Number: GRM1555C1H120JA01D; Mouser Part Number: 81-GRM1555C1H120JA1D; Mouser Price/Stock: https://www.mouser.co.uk/ProductDetail/Murata-Electronics/GRM1555C1H120JA01D?qs=to8XolpOzrOCHudLswyzbw%3D%3D; Arrow Part Number: GRM1555C1H120JA01D; Arrow Price/Stock: https://www.arrow.com/en/products/grm1555c1h120ja01d/murata-manufacturing?region=nac
C27 = GRM1555C1H1R8CA01D: Capacitor; Manufacturer_Name: Murata Electronics; Datasheet Link: http://www.murata.com/~/media/webrenewal/support/library/catalog/products/capacitor/mlcc/c02e.pdf; Height: 0.55mm; Manufacturer_Part_Number: GRM1555C1H1R8CA01D; Mouser Part Number: 81-GRM1555C1H1R8CA1D; Mouser Price/Stock: https://www.mouser.co.uk/ProductDetail/Murata-Electronics/GRM1555C1H1R8CA01D?qs=4k9rjS6ZRl5xsfkvNAudjg%3D%3D; Arrow Part Number: GRM1555C1H1R8CA01D; Arrow Price/Stock: https://www.arrow.com/en/products/grm1555c1h1r8ca01d/murata-manufacturing?region=nac
C28 = GJM1555C1H1R0BB01J: Capacitor 1pF 5V; Manufacturer_Name: Murata Electronics; Datasheet Link: https://psearch.en.murata.com/capacitor/product/GJM1555C1H1R0BB01%23.html; Height: 0.55mm; Manufacturer_Part_Number: GJM1555C1H1R0BB01J; Mouser Part Number: 81-GJM1555C1H1R0BB1J; Mouser Price/Stock: https://www.mouser.co.uk/ProductDetail/Murata-Electronics/GJM1555C1H1R0BB01J?qs=QDXoN8f0aYKhYDjDsFjbQw%3D%3D; Arrow Part Number: GJM1555C1H1R0BB01J; Arrow Price/Stock: https://www.arrow.com/en/products/gjm1555c1h1r0bb01j/murata-manufacturing
C29 = GRM1555C1H1R2CA01D: Capacitor; Manufacturer_Name: Murata Electronics; Datasheet Link: http://www.murata.com/~/media/webrenewal/support/library/catalog/products/capacitor/mlcc/c02e.pdf; Height: 0.55mm; Manufacturer_Part_Number: GRM1555C1H1R2CA01D; Mouser Part Number: 81-GRM1555C1H1R2CA1D; Mouser Price/Stock: https://www.mouser.com/Search/ProductDetail.aspx?qs=to8XolpOzrP6nx%252b3wqoCBw%3d%3d
C30 = GJM1555C1H1R0BB01J: Capacitor 1pF; Manufacturer_Name: Murata Electronics; Datasheet Link: https://psearch.en.murata.com/capacitor/product/GJM1555C1H1R0BB01%23.html; Height: 0.55mm; Manufacturer_Part_Number: GJM1555C1H1R0BB01J; Mouser Part Number: 81-GJM1555C1H1R0BB1J; Mouser Price/Stock: https://www.mouser.co.uk/ProductDetail/Murata-Electronics/GJM1555C1H1R0BB01J?qs=QDXoN8f0aYKhYDjDsFjbQw%3D%3D; Arrow Part Number: GJM1555C1H1R0BB01J; Arrow Price/Stock: https://www.arrow.com/en/products/gjm1555c1h1r0bb01j/murata-manufacturing
C31 = GRM155R61A105KE15D: Capacitor 1uF 10V X5R; Manufacturer_Name: Murata Electronics; Datasheet Link: http://www.murata.com/~/media/webrenewal/support/library/catalog/products/capacitor/mlcc/c02e.pdf; Height: 0.55mm; Manufacturer_Part_Number: GRM155R61A105KE15D; Mouser Part Number: 81-GRM155R61A105KE15; Mouser Price/Stock: https://www.mouser.co.uk/ProductDetail/Murata-Electronics/GRM155R61A105KE15D?qs=mjAxHPhY7UcmPekRqw%2FAPA%3D%3D; Arrow Part Number: GRM155R61A105KE15D; Arrow Price/Stock: https://www.arrow.com/en/products/grm155r61a105ke15d/murata-manufacturing?region=europe
D1-D3 = TPD1E10B06DPYR: TVS Diode (Bi-directional); Manufacturer_Name: Texas Instruments; Datasheet Link: https://www.ti.com/lit/ds/symlink/tpd1e10b06.pdf?HQS=TI-null-null-mousermode-df-pf-null-wwe&ts=1599077798252&ref_url=https%253A%252F%252Fwww.mouser.com%252F; Height: 0.45mm; Manufacturer_Part_Number: TPD1E10B06DPYR; Mouser Part Number: 595-TPD1E10B06DPYR; Mouser Price/Stock: https://www.mouser.co.uk/ProductDetail/Texas-Instruments/TPD1E10B06DPYR?qs=UFc95S4Z4CaJYpQ4xqTc0g%3D%3D; Arrow Part Number: TPD1E10B06DPYR; Arrow Price/Stock: https://www.arrow.com/en/products/tpd1e10b06dpyr/texas-instruments?region=nac
FB1 = BLM18HE152SN1D: Ferrite Bead; Manufacturer_Name: Murata Electronics; Datasheet Link: http://www.murata.com/~/media/webrenewal/support/library/catalog/products/emc/emifil/c31e.ashx?la=en-gb; Height: 0.95mm; Manufacturer_Part_Number: BLM18HE152SN1D; Mouser Part Number: 81-BLM18HE152SN1D; Mouser Price/Stock: https://www.mouser.co.uk/ProductDetail/Murata-Electronics/BLM18HE152SN1D?qs=vNc2DXHODiLhczkT1FKS1Q%3D%3D; Arrow Part Number: BLM18HE152SN1D; Arrow Price/Stock: https://www.arrow.com/en/products/blm18he152sn1d/murata-manufacturing?utm_currency=USD&region=nac
IC3 = CC2640R2FTWRGZTQ1: Integrated Circuit; Manufacturer_Name: Texas Instruments; Datasheet Link: https://mouser.componentsearchengine.com/Datasheets/2/CC2640R2FTWRGZTQ1.pdf; Height: 1mm; Manufacturer_Part_Number: CC2640R2FTWRGZTQ1; Mouser Part Number: 595-2640R2FTWRGZTQ1; Mouser Price/Stock: https://www.mouser.co.uk/ProductDetail/Texas-Instruments/CC2640R2FTWRGZTQ1?qs=6BVwEky2YVwde1NefGxXhA%3D%3D; Arrow Part Number: CC2640R2FTWRGZTQ1; Arrow Price/Stock: https://www.arrow.com/en/products/cc2640r2ftwrgztq1/texas-instruments?region=nac
J1 = GRPB052VWVN-RC: Connector; Manufacturer_Name: Sullins; Datasheet Link: https://media.digikey.com/pdf/Data%20Sheets/Sullins%20PDFs/GRPB_%20_2VWVN-RC%2010954-C.pdf; Height: 4.3mm; Manufacturer_Part_Number: GRPB052VWVN-RC
L2 = CKS2125100M-T: Inductor,10uH; Manufacturer_Name: TAIYO YUDEN; Datasheet Link: http://www.farnell.com/datasheets/1913121.pdf; Height: 1.45mm; Manufacturer_Part_Number: CKS2125100M-T; Mouser Part Number: 963-CKS2125100M-T; Mouser Price/Stock: https://www.mouser.co.uk/ProductDetail/TAIYO-YUDEN/CKS2125100M-T?qs=I6KAKw0tg2zHq294SAdJZA%3D%3D
L3 = LQG15HN2N4S02D: Inductor 2.4 nH; Manufacturer_Name: Murata Electronics; Datasheet Link: https://psearch.en.murata.com/inductor/product/LQG15HN2N4S02%23.html; Height: 0.55mm; Manufacturer_Part_Number: LQG15HN2N4S02D; Mouser Part Number: 81-LQG15HN2N4S02D; Mouser Price/Stock: https://www.mouser.com/Search/Refine.aspx?Keyword=81-LQG15HN2N4S02D; Arrow Part Number: LQG15HN2N4S02D; Arrow Price/Stock: https://www.arrow.com/en/products/lqg15hn2n4s02d/murata-manufacturing
L4 L5 = LQG15HS2N0S02D: Inductor; Manufacturer_Name: Murata Electronics; Datasheet Link: https://psearch.en.murata.com/inductor/product/LQG15HS2N0S02%23.html; Height: 0.55mm; Manufacturer_Part_Number: LQG15HS2N0S02D; Mouser Part Number: 81-LQG15HS2N0S02D; Mouser Price/Stock: https://www.mouser.co.uk/ProductDetail/Murata-Electronics/LQG15HS2N0S02D?qs=z7wylDbq%2FU6uWxpTRPm4gA%3D%3D; Arrow Part Number: LQG15HS2N0S02D; Arrow Price/Stock: https://www.arrow.com/en/products/lqg15hs2n0s02d/murata-manufacturing?region=nac
L6 = LQG15HN2N4S02D: Inductor; Manufacturer_Name: Murata Electronics; Datasheet Link: https://psearch.en.murata.com/inductor/product/LQG15HN2N4S02%23.html; Height: 0.55mm; Manufacturer_Part_Number: LQG15HN2N4S02D; Mouser Part Number: 81-LQG15HN2N4S02D; Mouser Price/Stock: https://www.mouser.com/Search/Refine.aspx?Keyword=81-LQG15HN2N4S02D; Arrow Part Number: LQG15HN2N4S02D; Arrow Price/Stock: https://www.arrow.com/en/products/lqg15hn2n4s02d/murata-manufacturing
R5 = RMCF0402FT100K: Resistor; Manufacturer_Name: Stackpole Electronics; Datasheet Link: https://cs.seielect.com/catalog/SEI-RMCF_RMCP.pdf; Height: 0.35mm; Manufacturer_Part_Number: RMCF0402FT100K; Mouser Part Number: 708-RMCF0402FT100K; Mouser Price/Stock: https://www.mouser.co.uk/ProductDetail/SEI-Stackpole/RMCF0402FT100K?qs=FESYatJ8odIlocPFcyIG5Q%3D%3D; Arrow Part Number: RMCF0402FT100K; Arrow Price/Stock: https://www.arrow.com/en/products/rmcf0402ft100k/stackpole-electronics?region=asia
R6-R8 = CRCW040247K5FKED: Resistor; Manufacturer_Name: Vishay; Datasheet Link: http://www.vishay.com/docs/20035/dcrcwe3.pdf; Height: 0.4mm; Manufacturer_Part_Number: CRCW040247K5FKED; Mouser Part Number: 71-CRCW0402-47.5K-E3; Mouser Price/Stock: https://www.mouser.co.uk/ProductDetail/Vishay-Dale/CRCW040247K5FKED?qs=rzhQWu8UUS33UUFZR3Sagw%3D%3D; Arrow Part Number: CRCW040247K5FKED; Arrow Price/Stock: https://www.arrow.com/en/products/crcw040247k5fked/vishay
R9 R10 = ERJ-3GEYJ472V: Resistor; Manufacturer_Name: Panasonic; Datasheet Link: http://docs-europe.electrocomponents.com/webdocs/13ba/0900766b813ba21b.pdf; Height: 0.55mm; Manufacturer_Part_Number: ERJ-3GEYJ472V; Mouser Part Number: 667-ERJ-3GEYJ472V; Mouser Price/Stock: https://www.mouser.co.uk/ProductDetail/Panasonic/ERJ-3GEYJ472V?qs=5Z1f76oN9PODrqkF4KFDng%3D%3D; Arrow Part Number: ERJ-3GEYJ472V; Arrow Price/Stock: https://www.arrow.com/en/products/erj-3geyj472v/panasonic?region=europe
R11 = RC0603FR-072K2L: Resistor; Manufacturer_Name: KEMET; Datasheet Link: http://www.yageo.com/documents/recent/PYu-RC0603_51_RoHS_L_v5.pdf; Height: 0.55mm; Manufacturer_Part_Number: RC0603FR-072K2L; Mouser Part Number: 603-RC0603FR-072K2L; Mouser Price/Stock: https://www.mouser.co.uk/ProductDetail/YAGEO/RC0603FR-072K2L?qs=diQw95jMAeOQmNpe2MM%252BPw%3D%3D; Arrow Part Number: RC0603FR-072K2L; Arrow Price/Stock: https://www.arrow.com/en/products/rc0603fr-072k2l/yageo?region=nac
R12 R13 = ERJ-3EKF1002V: Resistor; Manufacturer_Name: Panasonic; Datasheet Link: http://industrial.panasonic.com/cdbs/www-data/pdf/RDA0000/AOA0000C86.pdf; Height: 0.55mm; Manufacturer_Part_Number: ERJ-3EKF1002V; Mouser Part Number: 667-ERJ-3EKF1002V; Mouser Price/Stock: https://www.mouser.co.uk/ProductDetail/Panasonic/ERJ-3EKF1002V?qs=H7k1u0Mp9JSrGPQ5%2F5COuw%3D%3D; Arrow Part Number: ERJ-3EKF1002V; Arrow Price/Stock: https://www.arrow.com/en/products/erj-3ekf1002v/panasonic?region=europe
S1-S4 = EL2_35_20J_LFS: Switch; Manufacturer_Name: LITTELFUSE; Manufacturer_Part_Number: EL2 35 20J LFS; Datasheet Link: https://www.ckswitches.com/media/3758/el2.pdf; Height: 3.7mm
U1 = 2.4GHz Antenna
Y1 = TSX-3225_24.0000MF20G-AC3: Crystal or Oscillator; Manufacturer_Name: Epson Timing; Manufacturer_Part_Number: TSX-3225 24.0000MF20G-AC3; Datasheet Link: https://support.epson.biz/td/api/doc_check.php?dl=brief_FA-238V_en.pdf; Mouser Part Number: 732-TX325-24F20G-AC3; Mouser Price/Stock: https://www.mouser.co.uk/ProductDetail/Epson-Timing/TSX-3225-24.0000MF20G-AC3?qs=tC2qD9afNgou1YHpctmuPA%3D%3D; Arrow Part Number: TSX-3225 24.0000MF20G-AC3; Arrow Price/Stock: https://www.arrow.com/en/products/tsx-322524.0000mf20g-ac3/epson-electronics-america?region=nac
Y2 = FC-12M32.7680KA-A5: Parallel - Fundamental Quartz Crystal, 0.032768MHz Nom; Manufacturer: Epson; Supplier: Mouser; Supplier Part Number: 732-FC-12M32.768KAA5; Manufacturer Part Number: FC-12M32.7680KA-A5; RoHS: Yes; Category: Crystals; Stock: 52995; Pricing: 1=0.65, 10=0.506, 50=0.506, 100=0.455, 1000=0.39, 10000=0.366 (USD); Terminal Finish: Gold; Min Operating Temperature: -40°C; Max Operating Temperature: 85°C; JESD-609 Code: e4; Crystal/Resonator Type: PARALLEL - FUNDAMENTAL; Operating Frequency-Nom: 0.032768; Reach SVHC Compliant: Yes; RoHS Compliant: Yes; ComponentLink1URL: https://datasheet.ciiva.com:443/pdfs/VipMasterIC/IC/SEIK/SEIK-S-A0008395574/SEIK-S-A0008395574-1.pdf?src-supplier=IHS+Markit; ComponentLink1Description: https://datasheet.ciiva.com:443/pdfs/VipMasterIC/IC/SEIK/SEIK-S-A0008395574/SEIK-S-A0008395574-1.pdf?src-supplier=IHS+Markit; ComponentLink2URL: https://datasheet.ciiva.com/12388/1407447-3083-12388132.pdf?src-supplier=Mouser; ComponentLink2Description: https://datasheet.ciiva.com/12388/1407447-3083-12388132.pdf?src-supplier=Mouser

## Sheet LP55231 LED DRIVER.SchDoc
size A4; SheetNumber: 4; SheetTotal: 4
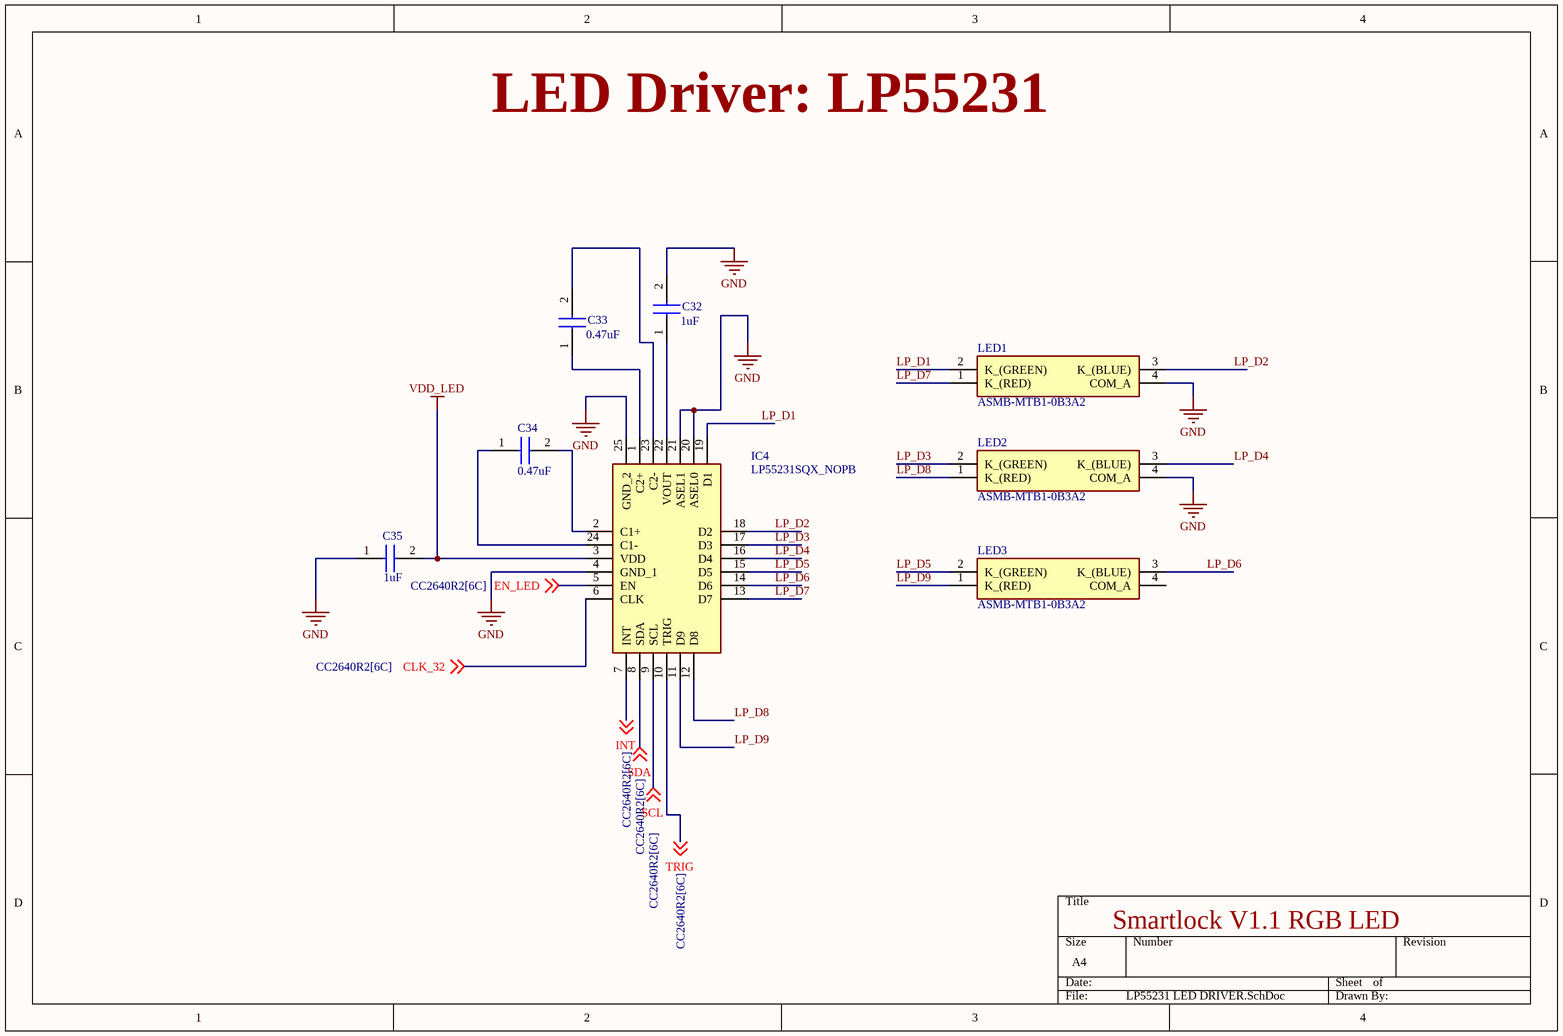
[diagram p4: LP55231 LED DRIVER.SchDoc]

### Parts
C32  1uF  [CAPC1005X55N]
C33  0.47uF  [CAPC1005X55N]
C34  0.47uF  [CAPC1005X55N]
C35  1uF  [CAPC1005X55N]
IC4  LP55231SQX_NOPB  [QFN50P400X400X80-25N]
LED1  ASMB-MTB1-0B3A2  [ASMBMTB10B3A2]
LED2  ASMB-MTB1-0B3A2  [ASMBMTB10B3A2]
LED3  ASMB-MTB1-0B3A2  [ASMBMTB10B3A2]

### Nets
GND: C32.2 C35.1 IC4.4(GND_1) IC4.20(ASEL0) IC4.21(ASEL1) IC4.25(GND_2) LED1.4(COM_A) LED2.4(COM_A)
VDD_LED: C35.2 IC4.3(VDD)
CLK_32: IC4.6(CLK) ; off-sheet CLK_32
EN_LED: IC4.5(EN) ; off-sheet EN_LED
INT: IC4.7(INT) ; off-sheet INT
LP_D1: IC4.19(D1) LED1.2(K_(GREEN))
LP_D2: IC4.18(D2) LED1.3(K_(BLUE))
LP_D3: IC4.17(D3) LED2.2(K_(GREEN))
LP_D4: IC4.16(D4) LED2.3(K_(BLUE))
LP_D5: IC4.15(D5) LED3.2(K_(GREEN))
LP_D6: IC4.14(D6) LED3.3(K_(BLUE))
LP_D7: IC4.13(D7) LED1.1(K_(RED))
LP_D8: IC4.12(D8) LED2.1(K_(RED))
LP_D9: IC4.11(D9) LED3.1(K_(RED))
SCL: IC4.9(SCL) ; off-sheet SCL
SDA: IC4.8(SDA) ; off-sheet SDA
TRIG: IC4.10(TRIG) ; off-sheet TRIG
NetC32_1: C32.1 IC4.22(VOUT)
NetC33_1: C33.1 IC4.1(C2+)
NetC33_2: C33.2 IC4.23(C2-)
NetC34_1: C34.1 IC4.24(C1-)
NetC34_2: C34.2 IC4.2(C1+)

Not connected (* = marked no-connect by the designer): LED3 4(COM_A)

### Notes on the sheet
- LED Driver: LP55231
- Smartlock V1.1 RGB LED

### Library data of the parts
C32 = GRM155R61A105KE15D: Capacitor 1uF 10V; Manufacturer_Name: Murata Electronics; Datasheet Link: http://www.murata.com/~/media/webrenewal/support/library/catalog/products/capacitor/mlcc/c02e.pdf; Height: 0.55mm; Manufacturer_Part_Number: GRM155R61A105KE15D; Mouser Part Number: 81-GRM155R61A105KE15; Mouser Price/Stock: https://www.mouser.co.uk/ProductDetail/Murata-Electronics/GRM155R61A105KE15D?qs=mjAxHPhY7UcmPekRqw%2FAPA%3D%3D; Arrow Part Number: GRM155R61A105KE15D; Arrow Price/Stock: https://www.arrow.com/en/products/grm155r61a105ke15d/murata-manufacturing?region=europe
C33 C34 = C1005X5R1A474K050BB: Capacitor 0.47uF 10V X5R; Manufacturer_Name: TDK; Datasheet Link: https://product.tdk.com/info/en/catalog/datasheets/mlcc_commercial_midvoltage_en.pdf; Height: 0.55mm; Manufacturer_Part_Number: C1005X5R1A474K050BB; Mouser Part Number: 810-C1005X5R1A474K; Mouser Price/Stock: https://www.mouser.com/Search/Refine.aspx?Keyword=810-C1005X5R1A474K
C35 = GRM155R61A105KE15D: as C31 on sheet CC2640R2; Datasheet Link: http://www.murata.com/~/media/webrenewal/support/library/catalog/products/capacitor/mlcc/c02e.pdf; Height: 0.55mm; Manufacturer_Part_Number: GRM155R61A105KE15D; Mouser Part Number: 81-GRM155R61A105KE15; Mouser Price/Stock: https://www.mouser.co.uk/ProductDetail/Murata-Electronics/GRM155R61A105KE15D?qs=mjAxHPhY7UcmPekRqw%2FAPA%3D%3D; Arrow Part Number: GRM155R61A105KE15D; Arrow Price/Stock: https://www.arrow.com/en/products/grm155r61a105ke15d/murata-manufacturing?region=europe
IC4 = LP55231SQX_NOPB: Integrated Circuit; Manufacturer_Name: Texas Instruments; Manufacturer_Part_Number: LP55231SQX/NOPB; Datasheet Link: http://www.ti.com/lit/gpn/lp55231; Height: 0.8mm; Mouser Part Number: 595-LP55231SQX/NOPB; Mouser Price/Stock: https://www.mouser.co.uk/ProductDetail/Texas-Instruments/LP55231SQX-NOPB?qs=HF2YfZwisE8IcIRPR19gTw%3D%3D; Arrow Part Number: LP55231SQX/NOPB; Arrow Price/Stock: https://www.arrow.com/en/products/lp55231sqxnopb/texas-instruments?region=nac
LED1-LED3 = ASMB-MTB1-0B3A2: LED; Manufacturer_Name: Avago Technologies; Datasheet Link: https://docs.broadcom.com/doc/AV02-4194EN; Height: 2.1mm; Manufacturer_Part_Number: ASMB-MTB1-0B3A2; Mouser Part Number: 630-ASMB-MTB1-0B3A2; Mouser Price/Stock: https://www.mouser.co.uk/ProductDetail/Broadcom-Avago/ASMB-MTB1-0B3A2?qs=pUKx8fyJudDzsc2Rt%2Fv8dg%3D%3D

## Nets that join several sheets
3V: Powersupply (6 pins), DRV8833_Motordrive (R3.2), CC2640R2 (FB1.1)
6V: Powersupply (9 pins), DRV8833_Motordrive (C4.2 C5.1 IC2.12)
GND: Powersupply (9 pins), DRV8833_Motordrive (C5.2 C6.1 IC2.13 R4.1), CC2640R2 (40 pins), LP55231 LED DRIVER (8 pins)
ADC_BATT: Powersupply (R1.2 R2.2), CC2640R2 (IC3.17)
CLK_32: CC2640R2 (IC3.8), LP55231 LED DRIVER (IC4.6)
EN_BATT: Powersupply (IC1.4), CC2640R2 (IC3.16)
EN_LED: CC2640R2 (IC3.7 R11.1), LP55231 LED DRIVER (IC4.5)
IN1: DRV8833_Motordrive (IC2.9 IC2.16), CC2640R2 (IC3.14)
IN2: DRV8833_Motordrive (IC2.10 IC2.15), CC2640R2 (IC3.15)
INT: CC2640R2 (IC3.10 R13.1), LP55231 LED DRIVER (IC4.7)
nFault: DRV8833_Motordrive (IC2.8 R3.1), CC2640R2 (IC3.12)
nSleep: DRV8833_Motordrive (IC2.1), CC2640R2 (IC3.11)
SCL: CC2640R2 (IC3.6 R10.1), LP55231 LED DRIVER (IC4.9)
SDA: CC2640R2 (IC3.5 R9.1), LP55231 LED DRIVER (IC4.8)
TRIG: CC2640R2 (IC3.9 R12.1), LP55231 LED DRIVER (IC4.10)